# Altium schematic sheet P08_F28379D-IO1.SchDoc
size 301 x 239 mm
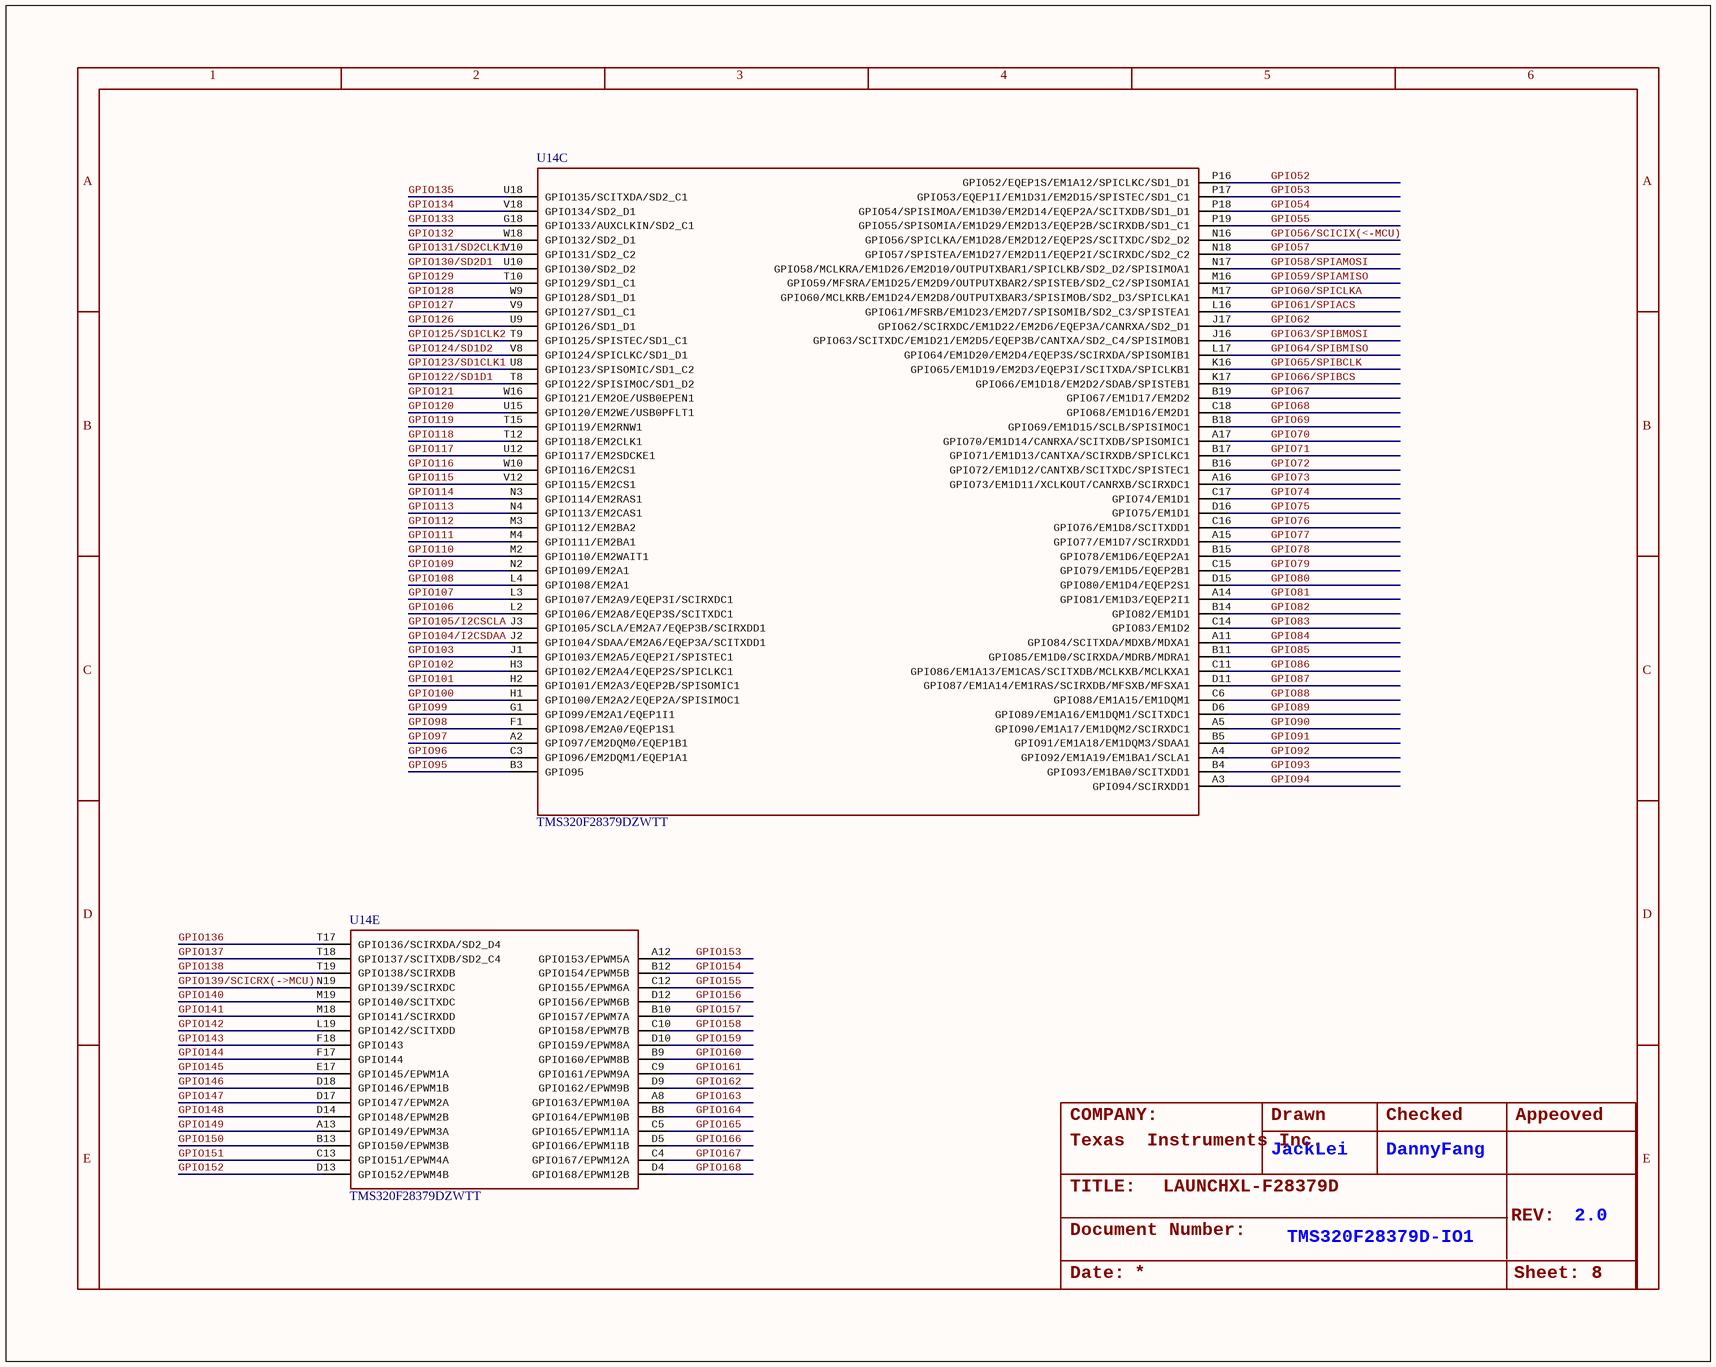
[diagram p0: P08_F28379D-IO1.SchDoc]

## Parts
U14  TMS320F28379DZWTT  [BGA337C80P19X19_1600X1600X140]  (parts C,E of 5)

## Nets
GPIO52: U14.P16(GPIO52/EQEP1S/EM1A12/SPICLKC/SD1_D1)
GPIO53: U14.P17(GPIO53/EQEP1I/EM1D31/EM2D15/SPISTEC/SD1_C1)
GPIO54: U14.P18(GPIO54/SPISIMOA/EM1D30/EM2D14/EQEP2A/SCITXDB/SD1_D1)
GPIO55: U14.P19(GPIO55/SPISOMIA/EM1D29/EM2D13/EQEP2B/SCIRXDB/SD1_C1)
GPIO56/SCICIX(<-MCU): U14.N16(GPIO56/SPICLKA/EM1D28/EM2D12/EQEP2S/SCITXDC/SD2_D2)
GPIO57: U14.N18(GPIO57/SPISTEA/EM1D27/EM2D11/EQEP2I/SCIRXDC/SD2_C2)
GPIO58/SPIAMOSI: U14.N17(GPIO58/MCLKRA/EM1D26/EM2D10/OUTPUTXBAR1/SPICLKB/SD2_D2/SPISIMOA1)
GPIO59/SPIAMISO: U14.M16(GPIO59/MFSRA/EM1D25/EM2D9/OUTPUTXBAR2/SPISTEB/SD2_C2/SPISOMIA1)
GPIO60/SPICLKA: U14.M17(GPIO60/MCLKRB/EM1D24/EM2D8/OUTPUTXBAR3/SPISIMOB/SD2_D3/SPICLKA1)
GPIO61/SPIACS: U14.L16(GPIO61/MFSRB/EM1D23/EM2D7/SPISOMIB/SD2_C3/SPISTEA1)
GPIO62: U14.J17(GPIO62/SCIRXDC/EM1D22/EM2D6/EQEP3A/CANRXA/SD2_D1)
GPIO63/SPIBMOSI: U14.J16(GPIO63/SCITXDC/EM1D21/EM2D5/EQEP3B/CANTXA/SD2_C4/SPISIMOB1)
GPIO64/SPIBMISO: U14.L17(GPIO64/EM1D20/EM2D4/EQEP3S/SCIRXDA/SPISOMIB1)
GPIO65/SPIBCLK: U14.K16(GPIO65/EM1D19/EM2D3/EQEP3I/SCITXDA/SPICLKB1)
GPIO66/SPIBCS: U14.K17(GPIO66/EM1D18/EM2D2/SDAB/SPISTEB1)
GPIO67: U14.B19(GPIO67/EM1D17/EM2D2)
GPIO68: U14.C18(GPIO68/EM1D16/EM2D1)
GPIO69: U14.B18(GPIO69/EM1D15/SCLB/SPISIMOC1)
GPIO70: U14.A17(GPIO70/EM1D14/CANRXA/SCITXDB/SPISOMIC1)
GPIO71: U14.B17(GPIO71/EM1D13/CANTXA/SCIRXDB/SPICLKC1)
GPIO72: U14.B16(GPIO72/EM1D12/CANTXB/SCITXDC/SPISTEC1)
GPIO73: U14.A16(GPIO73/EM1D11/XCLKOUT/CANRXB/SCIRXDC1)
GPIO74: U14.C17(GPIO74/EM1D1)
GPIO75: U14.D16(GPIO75/EM1D1)
GPIO76: U14.C16(GPIO76/EM1D8/SCITXDD1)
GPIO77: U14.A15(GPIO77/EM1D7/SCIRXDD1)
GPIO78: U14.B15(GPIO78/EM1D6/EQEP2A1)
GPIO79: U14.C15(GPIO79/EM1D5/EQEP2B1)
GPIO80: U14.D15(GPIO80/EM1D4/EQEP2S1)
GPIO81: U14.A14(GPIO81/EM1D3/EQEP2I1)
GPIO82: U14.B14(GPIO82/EM1D1)
GPIO83: U14.C14(GPIO83/EM1D2)
GPIO84: U14.A11(GPIO84/SCITXDA/MDXB/MDXA1)
GPIO85: U14.B11(GPIO85/EM1D0/SCIRXDA/MDRB/MDRA1)
GPIO86: U14.C11(GPIO86/EM1A13/EM1CAS/SCITXDB/MCLKXB/MCLKXA1)
GPIO87: U14.D11(GPIO87/EM1A14/EM1RAS/SCIRXDB/MFSXB/MFSXA1)
GPIO88: U14.C6(GPIO88/EM1A15/EM1DQM1)
GPIO89: U14.D6(GPIO89/EM1A16/EM1DQM1/SCITXDC1)
GPIO90: U14.A5(GPIO90/EM1A17/EM1DQM2/SCIRXDC1)
GPIO91: U14.B5(GPIO91/EM1A18/EM1DQM3/SDAA1)
GPIO92: U14.A4(GPIO92/EM1A19/EM1BA1/SCLA1)
GPIO93: U14.B4(GPIO93/EM1BA0/SCITXDD1)
GPIO94: U14.A3(GPIO94/SCIRXDD1)
GPIO95: U14.B3(GPIO95)
GPIO96: U14.C3(GPIO96/EM2DQM1/EQEP1A1)
GPIO97: U14.A2(GPIO97/EM2DQM0/EQEP1B1)
GPIO98: U14.F1(GPIO98/EM2A0/EQEP1S1)
GPIO99: U14.G1(GPIO99/EM2A1/EQEP1I1)
GPIO100: U14.H1(GPIO100/EM2A2/EQEP2A/SPISIMOC1)
GPIO101: U14.H2(GPIO101/EM2A3/EQEP2B/SPISOMIC1)
GPIO102: U14.H3(GPIO102/EM2A4/EQEP2S/SPICLKC1)
GPIO103: U14.J1(GPIO103/EM2A5/EQEP2I/SPISTEC1)
GPIO104/I2CSDAA: U14.J2(GPIO104/SDAA/EM2A6/EQEP3A/SCITXDD1)
GPIO105/I2CSCLA: U14.J3(GPIO105/SCLA/EM2A7/EQEP3B/SCIRXDD1)
GPIO106: U14.L2(GPIO106/EM2A8/EQEP3S/SCITXDC1)
GPIO107: U14.L3(GPIO107/EM2A9/EQEP3I/SCIRXDC1)
GPIO108: U14.L4(GPIO108/EM2A1)
GPIO109: U14.N2(GPIO109/EM2A1)
GPIO110: U14.M2(GPIO110/EM2WAIT1)
GPIO111: U14.M4(GPIO111/EM2BA1)
GPIO112: U14.M3(GPIO112/EM2BA2)
GPIO113: U14.N4(GPIO113/EM2CAS1)
GPIO114: U14.N3(GPIO114/EM2RAS1)
GPIO115: U14.V12(GPIO115/EM2CS1)
GPIO116: U14.W10(GPIO116/EM2CS1)
GPIO117: U14.U12(GPIO117/EM2SDCKE1)
GPIO118: U14.T12(GPIO118/EM2CLK1)
GPIO119: U14.T15(GPIO119/EM2RNW1)
GPIO120: U14.U15(GPIO120/EM2WE/USB0PFLT1)
GPIO121: U14.W16(GPIO121/EM2OE/USB0EPEN1)
GPIO122/SD1D1: U14.T8(GPIO122/SPISIMOC/SD1_D2)
GPIO123/SD1CLK1: U14.U8(GPIO123/SPISOMIC/SD1_C2)
GPIO124/SD1D2: U14.V8(GPIO124/SPICLKC/SD1_D1)
GPIO125/SD1CLK2: U14.T9(GPIO125/SPISTEC/SD1_C1)
GPIO126: U14.U9(GPIO126/SD1_D1)
GPIO127: U14.V9(GPIO127/SD1_C1)
GPIO128: U14.W9(GPIO128/SD1_D1)
GPIO129: U14.T10(GPIO129/SD1_C1)
GPIO130/SD2D1: U14.U10(GPIO130/SD2_D2)
GPIO131/SD2CLK1: U14.V10(GPIO131/SD2_C2)
GPIO132: U14.W18(GPIO132/SD2_D1)
GPIO133: U14.G18(GPIO133/AUXCLKIN/SD2_C1)
GPIO134: U14.V18(GPIO134/SD2_D1)
GPIO135: U14.U18(GPIO135/SCITXDA/SD2_C1)
GPIO136: U14.T17(GPIO136/SCIRXDA/SD2_D4)
GPIO137: U14.T18(GPIO137/SCITXDB/SD2_C4)
GPIO138: U14.T19(GPIO138/SCIRXDB)
GPIO139/SCICRX(->MCU): U14.N19(GPIO139/SCIRXDC)
GPIO140: U14.M19(GPIO140/SCITXDC)
GPIO141: U14.M18(GPIO141/SCIRXDD)
GPIO142: U14.L19(GPIO142/SCITXDD)
GPIO143: U14.F18(GPIO143)
GPIO144: U14.F17(GPIO144)
GPIO145: U14.E17(GPIO145/EPWM1A)
GPIO146: U14.D18(GPIO146/EPWM1B)
GPIO147: U14.D17(GPIO147/EPWM2A)
GPIO148: U14.D14(GPIO148/EPWM2B)
GPIO149: U14.A13(GPIO149/EPWM3A)
GPIO150: U14.B13(GPIO150/EPWM3B)
GPIO151: U14.C13(GPIO151/EPWM4A)
GPIO152: U14.D13(GPIO152/EPWM4B)
GPIO153: U14.A12(GPIO153/EPWM5A)
GPIO154: U14.B12(GPIO154/EPWM5B)
GPIO155: U14.C12(GPIO155/EPWM6A)
GPIO156: U14.D12(GPIO156/EPWM6B)
GPIO157: U14.B10(GPIO157/EPWM7A)
GPIO158: U14.C10(GPIO158/EPWM7B)
GPIO159: U14.D10(GPIO159/EPWM8A)
GPIO160: U14.B9(GPIO160/EPWM8B)
GPIO161: U14.C9(GPIO161/EPWM9A)
GPIO162: U14.D9(GPIO162/EPWM9B)
GPIO163: U14.A8(GPIO163/EPWM10A)
GPIO164: U14.B8(GPIO164/EPWM10B)
GPIO165: U14.C5(GPIO165/EPWM11A)
GPIO166: U14.D5(GPIO166/EPWM11B)
GPIO167: U14.C4(GPIO167/EPWM12A)
GPIO168: U14.D4(GPIO168/EPWM12B)

## Notes on the sheet
- COMPANY:
- Texas
  Instruments Inc.
- JackLei
- Drawn
- Checked
- DannyFang
- Appeoved
- TITLE:
- Document Number:
- LAUNCHXL-F28379D
- TMS320F28379D-IO1
- REV:
- 2.0
- Date:
- Sheet:
- 8
- 1
- 2
- 3
- 4
- 5
- 6
- A
- B
- C
- D
- E

## Library data of the parts
U14 = 1002002100202C: IC, MCU 32BIT 1024KB,TMS320F28379DZWTT,BGA-337,SMD,customer supply; Manufacturer: TI; Embest PN: 1002002100202C; Value: TMS320F28379DZWTT; Part Type: MCU; Manufacturer Part Number: TMS320F28379DZWTT